# Altium schematic sheet No_Transistor_LED_INV.SchDoc: Inverted LED
size 203 x 127 mm; DrawnBy: Kace Chandler; DocumentNumber: 22; SheetNumber: 22; SheetTotal: 23
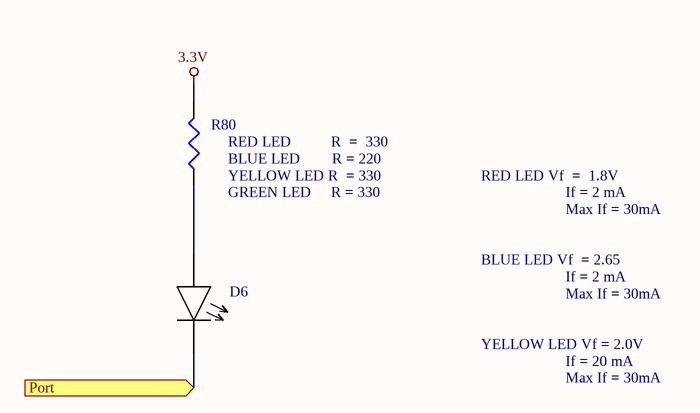
[diagram p0: No_Transistor_LED_INV.SchDoc]

## Parts
D6  LED_R  [0402 footprint]  (value not drawn)
R80  Res3  (value not drawn)

## Ports
Port (in)

## Nets
3.3V: R80.2
Port: D6.2 ; port Port
NetD6_1: D6.1 R80.1

## Notes on the sheet
- (near R80) RED LED          R  =  330
- (near R80) BLUE LED        R = 220
- (near R80) YELLOW LED R  = 330
- (near R80) GREEN LED     R = 330
- RED LED Vf  =  1.8V
- If = 2 mA
- Max If = 30mA
- BLUE LED Vf  = 2.65
- YELLOW LED Vf = 2.0V
- If = 20 mA

## Library data of the parts
R80 = Res3: Resistor; Value: Depends on the color of the LED; Published: 8-Jun-2000; LatestRevisionDate: 29-May-2009; LatestRevisionNote: IPC-7351 Footprint Added.; PackageReference: J1-0603; Publisher: Altium Limited; PackageDescription: Chip Resistor
D6 = LED_R: Supplier 1: Digi-Key; Supplier Part Number 1: 754-2123-1-ND